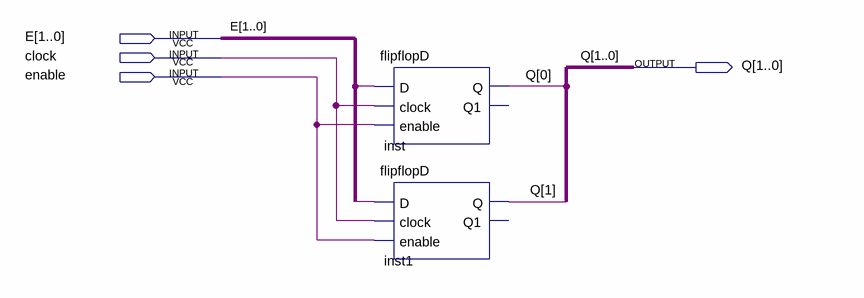
[diagram p0: schematic sheet]
// Quartus schematic reg2.bdf as structural Verilog: 2 symbols, 4 pins
module reg2 (
  input  [1:0] E,
  input  clock,
  input  enable,
  output [1:0] Q
);

  wire undriven, undriven_2;

  flipflopD inst (.D(undriven), .clock(clock), .enable(enable), .Q(Q[0]));  // open: Q1
  flipflopD inst1 (.D(undriven_2), .clock(clock), .enable(enable), .Q(Q[1]));  // open: Q1
endmodule
